# Altium schematic sheet Sheet_1_2025-10-29.schdoc
size 399 x 220 mm
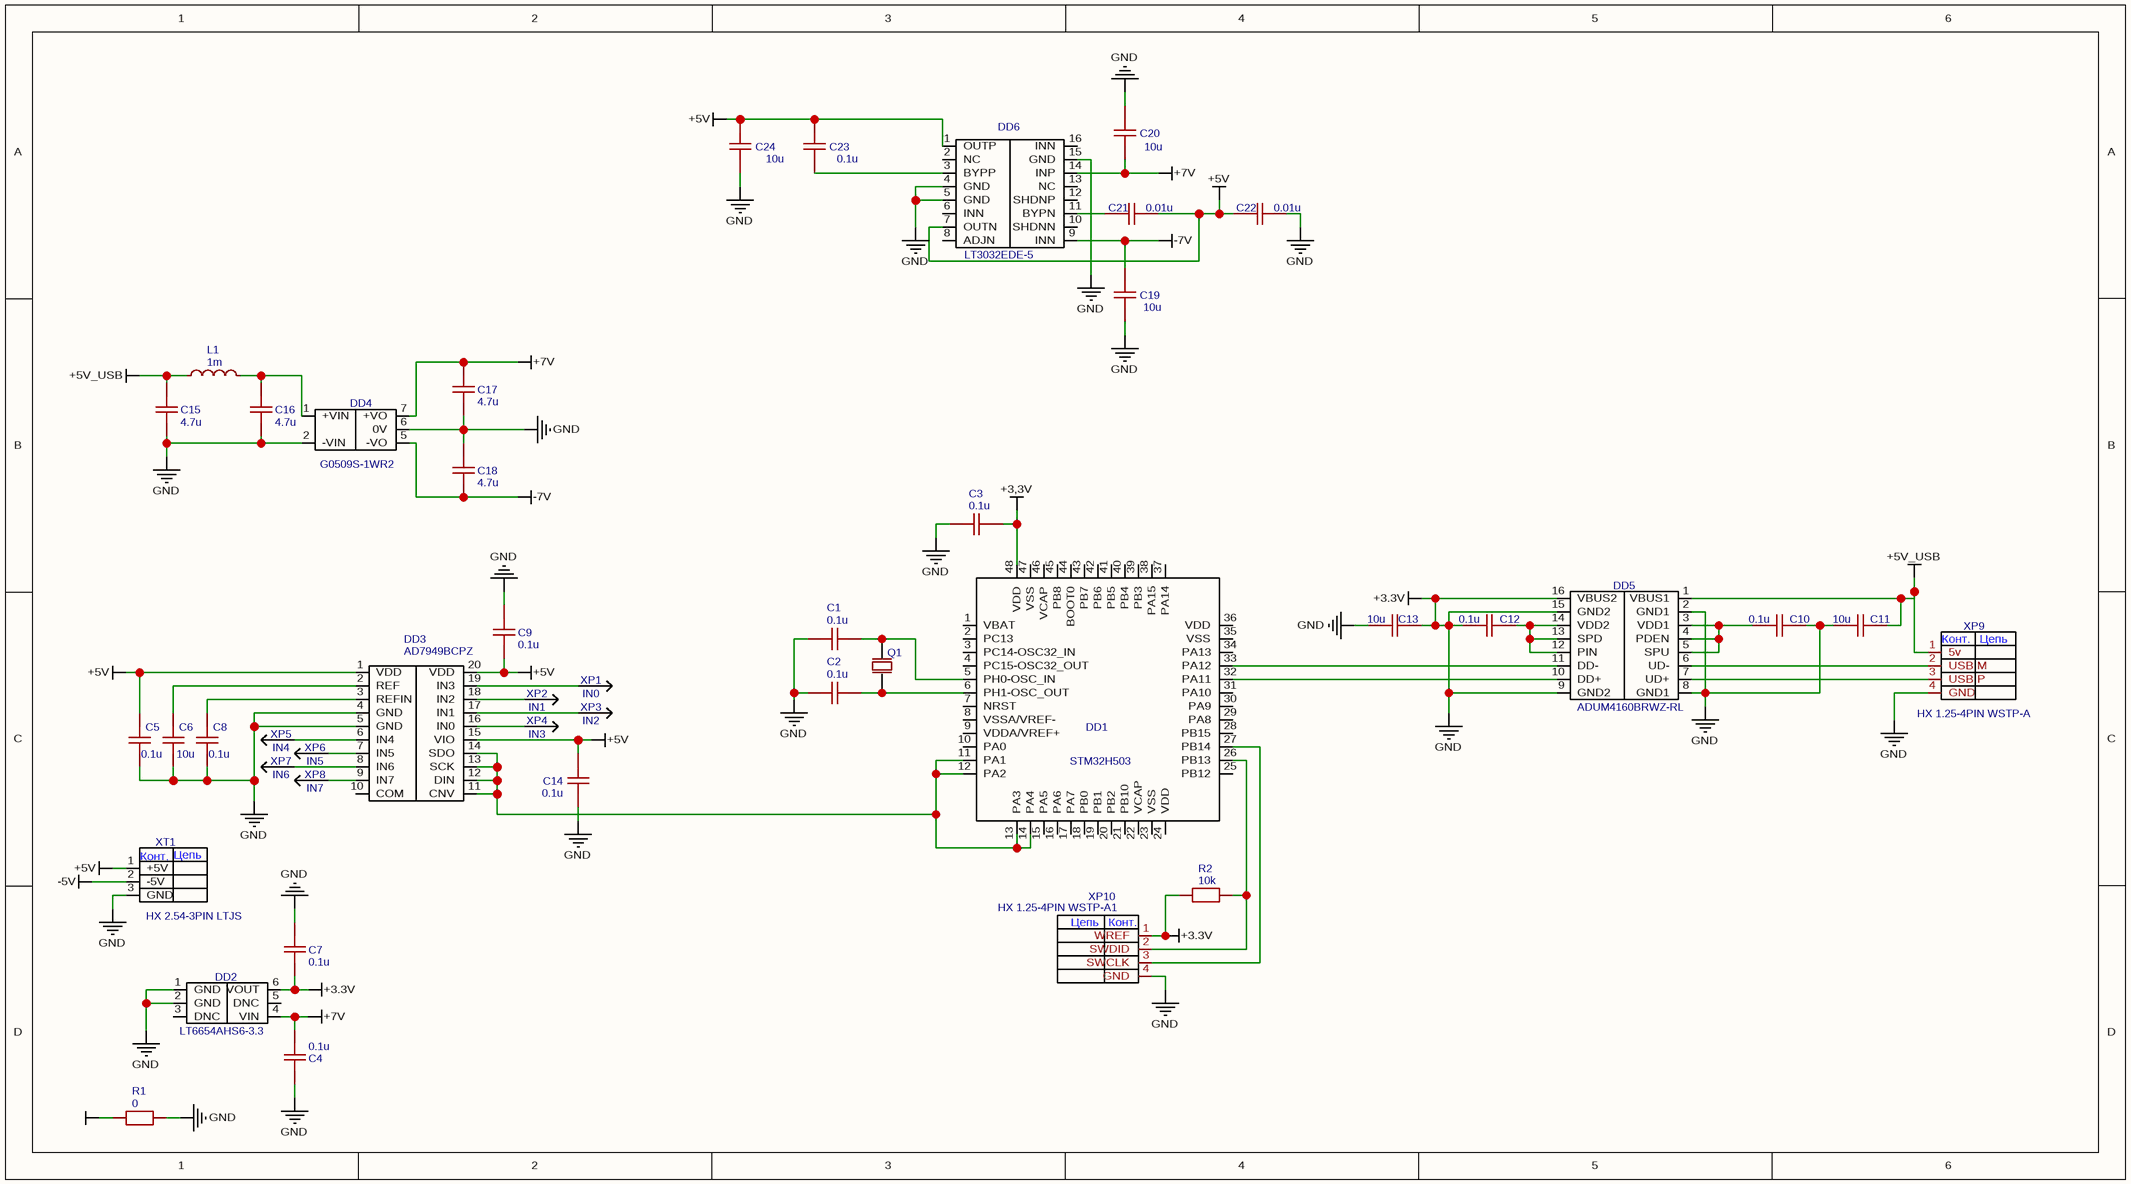
[diagram p0: Sheet_1_2025-10-29.schdoc]

## Parts
C1  0.1u  [C0603]
C2  0.1u  [C0603]
C3  0.1u  [C0603]
C4  0.1u  [C0603]
C5  0.1u  [C0603]
C6  10u  [C0603]
C7  0.1u  [C0603]
C8  0.1u  [C0603]
C9  0.1u  [C0603]
C10  0.1u  [C0603]
C11  10u  [C0603]
C12  0.1u  [C0603]
C13  10u  [C0603]
C14  0.1u  [C0603]
C15  4.7u  [C0603]
C16  4.7u  [C0603]
C17  4.7u  [C0603]
C18  4.7u  [C0603]
C19  10u  [C0603]
C20  10u  [C0603]
C21  0.01u  [C0603]
C22  0.01u  [C0603]
C23  0.1u  [C0603]
C24  10u  [C0603]
DD1  STM32H503  [LQFP-48_L7.0-W7.0-P0.50-LS9.0-BL]
DD2  LT6654AHS6-3.3  [TSOT-23-6_L2.9-W1.6-P0.95-LS2.8-BR]
DD3  AD7949BCPZ  [LFCSP-20_L4.0-W4.0-P0.50-BL-EP]
DD4  G0509S-1WR2  [PWRM-TH_7P-L19.5-W9.8-P2.54-PE3_4]
DD5  ADUM4160BRWZ-RL  [SOIC-16_L10.3-W7.5-P1.27-LS10.3-BL]
DD6  LT3032EDE-5  [DFN-14_L4.0-W3.0-P0.50-BL-EP_LT3032XXX]
L1  1m  [L0603]
Q1  HC-49SMD-XTAL_MD  [CRYSTAL-SMD_L11.4-W4.8-LS12.7]  (value not drawn)
R1  0  [R0603]
R2  10k  [R0603]
XP1  IN0  [HDR-M-2.54_1X1]
XP2  IN1  [HDR-M-2.54_1X1]
XP3  IN2  [HDR-M-2.54_1X1]
XP4  IN3  [HDR-M-2.54_1X1]
XP5  IN4  [HDR-M-2.54_1X1]
XP6  IN5  [HDR-M-2.54_1X1]
XP7  IN6  [HDR-M-2.54_1X1]
XP8  IN7  [HDR-M-2.54_1X1]
XP9  HX 1.25-4PIN WSTP-A  [CONN-SMD_4P-P1.25_HX-1.25-4PIN-WSTP]
XP10  HX 1.25-4PIN WSTP-A1  [CONN-SMD_4P-P1.25_HX-1.25-4PIN-WSTP]
XT1  HX 2.54-3PIN LTJS  [CONN-SMD_3P-P2.54_HX-2.54-3PIN-LTJS]

## Nets
+3,3V: C3.2 DD1.48(VDD)
+3.3V: C1.1 C2.1 C3.1 C4.2 C5.1 C6.1 C7.1 C7.2 C8.1 C9.1 C10.1 C11.2 C12.2 C13.1 C13.2 C14.1 C15.1 C16.1 C17.1 C18.2 C19.2 C20.1 C22.2 C24.1 DD2.1(GND) DD2.2(GND) DD2.6(VOUT) DD3.4(GND) DD3.5(GND) DD4.2(-VIN) DD4.6(0V) DD5.2(GND1) DD5.8(GND1) DD5.9(GND2) DD5.15(GND2) DD5.16(VBUS2) DD6.4(GND) DD6.5(GND) DD6.15(GND) R1.1 R1.2 R2.1 XP9.4(GND) XP10.1(WREF) XP10.4(GND) XT1.3(GND)  [also labelled GND]
+5V: C5.2 C9.2 C14.2 C21.2 C22.1 C23.2 C24.2 DD3.1(VDD) DD3.15(VIO) DD3.20(VDD) DD6.1(OUTP) DD6.7(OUTN) XT1.1(+5V)
+5V_USB: C11.1 C15.2 DD5.1(VBUS1) L1.1 XP9.1(5v)
+7V: C4.1 C17.2 C20.2 DD2.4(VIN) DD4.7(+VO) DD6.14(INP)
-5V: XT1.2(-5V)
-7V: C18.1 C19.1 DD4.5(-VO) DD6.9(INN)
NetC1_2: C1.2 DD1.5(PH0-OSC_IN) Q1.1(OSC1)
NetC2_2: C2.2 DD1.6(PH1-OSC_OUT) Q1.2(OSC2)
NetC6_2: C6.2 DD3.2(REF)
NetC8_2: C8.2 DD3.3(REFIN)
NetC10_2: C10.2 DD5.3(VDD1) DD5.4(PDEN) DD5.5(SPU)
NetC12_1: C12.1 DD5.12(PIN) DD5.13(SPD) DD5.14(VDD2)
NetC16_2: C16.2 DD4.1(+VIN) L1.2
NetC21_1: C21.1 DD6.11(BYPN)
NetC23_1: C23.1 DD6.3(BYPP)
NetDD1_11: DD1.11(PA1) DD1.12(PA2) DD1.13(PA3) DD1.14(PA4) DD3.11(CNV) DD3.12(DIN) DD3.13(SCK) DD3.14(SDO)
NetDD1_26: DD1.26(PB13) R2.2 XP10.2(SWDID)
NetDD1_27: DD1.27(PB14) XP10.3(SWCLK)
NetDD1_32: DD1.32(PA11) DD5.10(DD+)
NetDD1_33: DD1.33(PA12) DD5.11(DD-)
NetDD3_6: DD3.6(IN4) XP5.1
NetDD3_7: DD3.7(IN5) XP6.1
NetDD3_8: DD3.8(IN6) XP7.1
NetDD3_9: DD3.9(IN7) XP8.1
NetDD3_16: DD3.16(IN0) XP4.1
NetDD3_17: DD3.17(IN1) XP3.1
NetDD3_18: DD3.18(IN2) XP2.1
NetDD3_19: DD3.19(IN3) XP1.1
NetDD5_6: DD5.6(UD-) XP9.2(USB_M)
NetDD5_7: DD5.7(UD+) XP9.3(USB_P)

Not connected (* = marked no-connect by the designer): DD1 1(VBAT) 2(PC13) 3(PC14-OSC32_IN) 4(PC15-OSC32_OUT) 7(NRST) 8(VSSA/VREF-) 9(VDDA/VREF+) 10(PA0) 15(PA5) 16(PA6) 17(PA7) 18(PB0) 19(PB1) 20(PB2) 21(PB10) 22(VCAP) 23(VSS) 24(VDD) 25(PB12) 28(PB15) 29(PA8) 30(PA9) 31(PA10) 34(PA13) 35(VSS) 36(VDD) 37(PA14) 38(PA15) 39(PB3) 40(PB4) 41(PB5) 42(PB6) 43(PB7) 44(BOOT0) 45(PB8) 46(VCAP) 47(VSS); DD2 3(DNC) 5(DNC); DD3 10(COM); DD6 2(NC) 6(INN) 8(ADJN) 10(SHDNN) 12(SHDNP) 13(NC) 16(INN)

## Notes on the sheet
- (in symbol HX 1.25-4PIN WSTP-A) Конт.; Цепь
- (in symbol HX 1.25-4PIN WSTP-A1) Цепь; Конт.
- (in symbol HX 2.54-3PIN LTJS) Конт.; Цепь

## Library data of the parts
C1-C5 C7-C10 C12 C14 C23 = 0.1u: nameAlias: Value(F); Contributor: LCEDA_Lib; spicePre: C; spiceSymbolName: C_0603_US
C6 C11 C13 C19 C20 C24 = 10u: nameAlias: Value(F); Contributor: LCEDA_Lib; spicePre: C; spiceSymbolName: C_0603_US
C15-C18 = 4.7u: nameAlias: Value(F); Contributor: LCEDA_Lib; spicePre: C; spiceSymbolName: C_0603_US
C21 C22 = 0.01u: nameAlias: Value(F); Contributor: LCEDA_Lib; spicePre: C; spiceSymbolName: C_0603_US
DD1 = STM32H503: Manufacturer: ST(意法半导体); Manufacturer Part: STM32H503CBT6; Contributor: dipper.paints2002; Supplier: LCSC; Supplier Part: C17700273; JLCPCB Part Class: Extended Part; spicePre: D; spiceSymbolName: STM32H503
DD2 = LT6654AHS6-3.3: Manufacturer: ADI(亚德诺); Manufacturer Part: LT6654AHS6-3.3#TRMPBF; Contributor: dipper.paints2002; Supplier: LCSC; Supplier Part: C580254; JLCPCB Part Class: Extended Part; spicePre: D; spiceSymbolName: LT6654AHS6-3.3#TRMPBF
DD3 = AD7949BCPZ: Manufacturer: ADI(亚德诺); Contributor: dipper.paints2002; Supplier: LCSC; Supplier Part: C578571; Manufacturer Part: AD7949BCPZ; JLCPCB Part Class: Extended Part; spicePre: D; spiceSymbolName: AD7949BCPZ
DD4 = G0509S-1WR2: Manufacturer: YLPTEC(易川); Contributor: dipper.paints2002; Supplier: LCSC; Supplier Part: C7468988; Manufacturer Part: G0509S-1WR2; JLCPCB Part Class: Extended Part; spicePre: D; spiceSymbolName: G0509S-1WR2
DD5 = ADUM4160BRWZ-RL: Manufacturer: null; Contributor: dipper.paints2002; Supplier: LCSC; Supplier Part: C27586; Manufacturer Part: ADUM4160BRWZ-RL; JLCPCB Part Class: Extended Part; spicePre: D; spiceSymbolName: ADUM4160BRWZ-RL
DD6 = LT3032EDE-5: Manufacturer: ADI(亚德诺); Manufacturer Part: LT3032EDE-5#PBF; Contributor: dipper.paints2002; Supplier: LCSC; Supplier Part: C580007; JLCPCB Part Class: Extended Part; spicePre: D; spiceSymbolName: LT3032EDE-5#PBF
L1 = 1m: nameAlias: Value(H); Contributor: LCEDA_Lib; spicePre: L; spiceSymbolName: L0603_US
Q1 = HC-49SMD-XTAL_MD: Manufacturer: null; Contributor: LCSC; Supplier: LCSC; Supplier Part: C9900001361; Manufacturer Part: HC-49SMD-XTAL_MD; JLCPCB Part Class: Extended Part; spicePre: U; spiceSymbolName: HC-49SMD-XTAL_MD
R1 = 0: nameAlias: Value(Ω); Contributor: LCEDA_Lib; spicePre: R; spiceSymbolName: R_0603_EU
R2 = 10k: nameAlias: Value(Ω); Contributor: LCEDA_Lib; spicePre: R; spiceSymbolName: R_0603_EU
XP1 = IN0: Contributor: LCEDA_Lib; Supplier Part: C81276; Supplier: LCSC; spicePre: X; spiceSymbolName: HDR
XP2 = IN1: Contributor: LCEDA_Lib; Supplier Part: C81276; Supplier: LCSC; spicePre: X; spiceSymbolName: HDR
XP3 = IN2: Contributor: LCEDA_Lib; Supplier Part: C81276; Supplier: LCSC; spicePre: X; spiceSymbolName: HDR
XP4 = IN3: Contributor: LCEDA_Lib; Supplier Part: C81276; Supplier: LCSC; spicePre: X; spiceSymbolName: HDR
XP5 = IN4: Contributor: LCEDA_Lib; Supplier Part: C81276; Supplier: LCSC; spicePre: X; spiceSymbolName: HDR
XP6 = IN5: Contributor: LCEDA_Lib; Supplier Part: C81276; Supplier: LCSC; spicePre: X; spiceSymbolName: HDR
XP7 = IN6: Contributor: LCEDA_Lib; Supplier Part: C81276; Supplier: LCSC; spicePre: X; spiceSymbolName: HDR
XP8 = IN7: Contributor: LCEDA_Lib; Supplier Part: C81276; Supplier: LCSC; spicePre: X; spiceSymbolName: HDR
XP9 = HX 1.25-4PIN WSTP-A: Manufacturer: hanxia(韩下); Contributor: dipper.paints2002; Supplier: LCSC; Supplier Part: C19270002; Manufacturer Part: HX 1.25-4PIN WSTP; spicePre: X; spiceSymbolName: HX 1.25-4PIN WSTP-A
XP10 = HX 1.25-4PIN WSTP-A1: Manufacturer: hanxia(韩下); Contributor: dipper.paints2002; Supplier: LCSC; Supplier Part: C19270002; Manufacturer Part: HX 1.25-4PIN WSTP; spicePre: X; spiceSymbolName: HX 1.25-4PIN WSTP-A1
XT1 = HX 2.54-3PIN LTJS: Manufacturer: hanxia(韩下); Contributor: dipper.paints2002; Supplier: LCSC; Supplier Part: C19270025; Manufacturer Part: HX 2.54-3PIN LTJS; JLCPCB Part Class: Extended Part; spicePre: X; spiceSymbolName: HX 2.54-3PIN LTJS